# Altium schematic sheet Downstream_Port_1.SchDoc: = Title
size 431 x 279 mm; Revision: v1.0; SheetNumber: 5; SheetTotal: 7
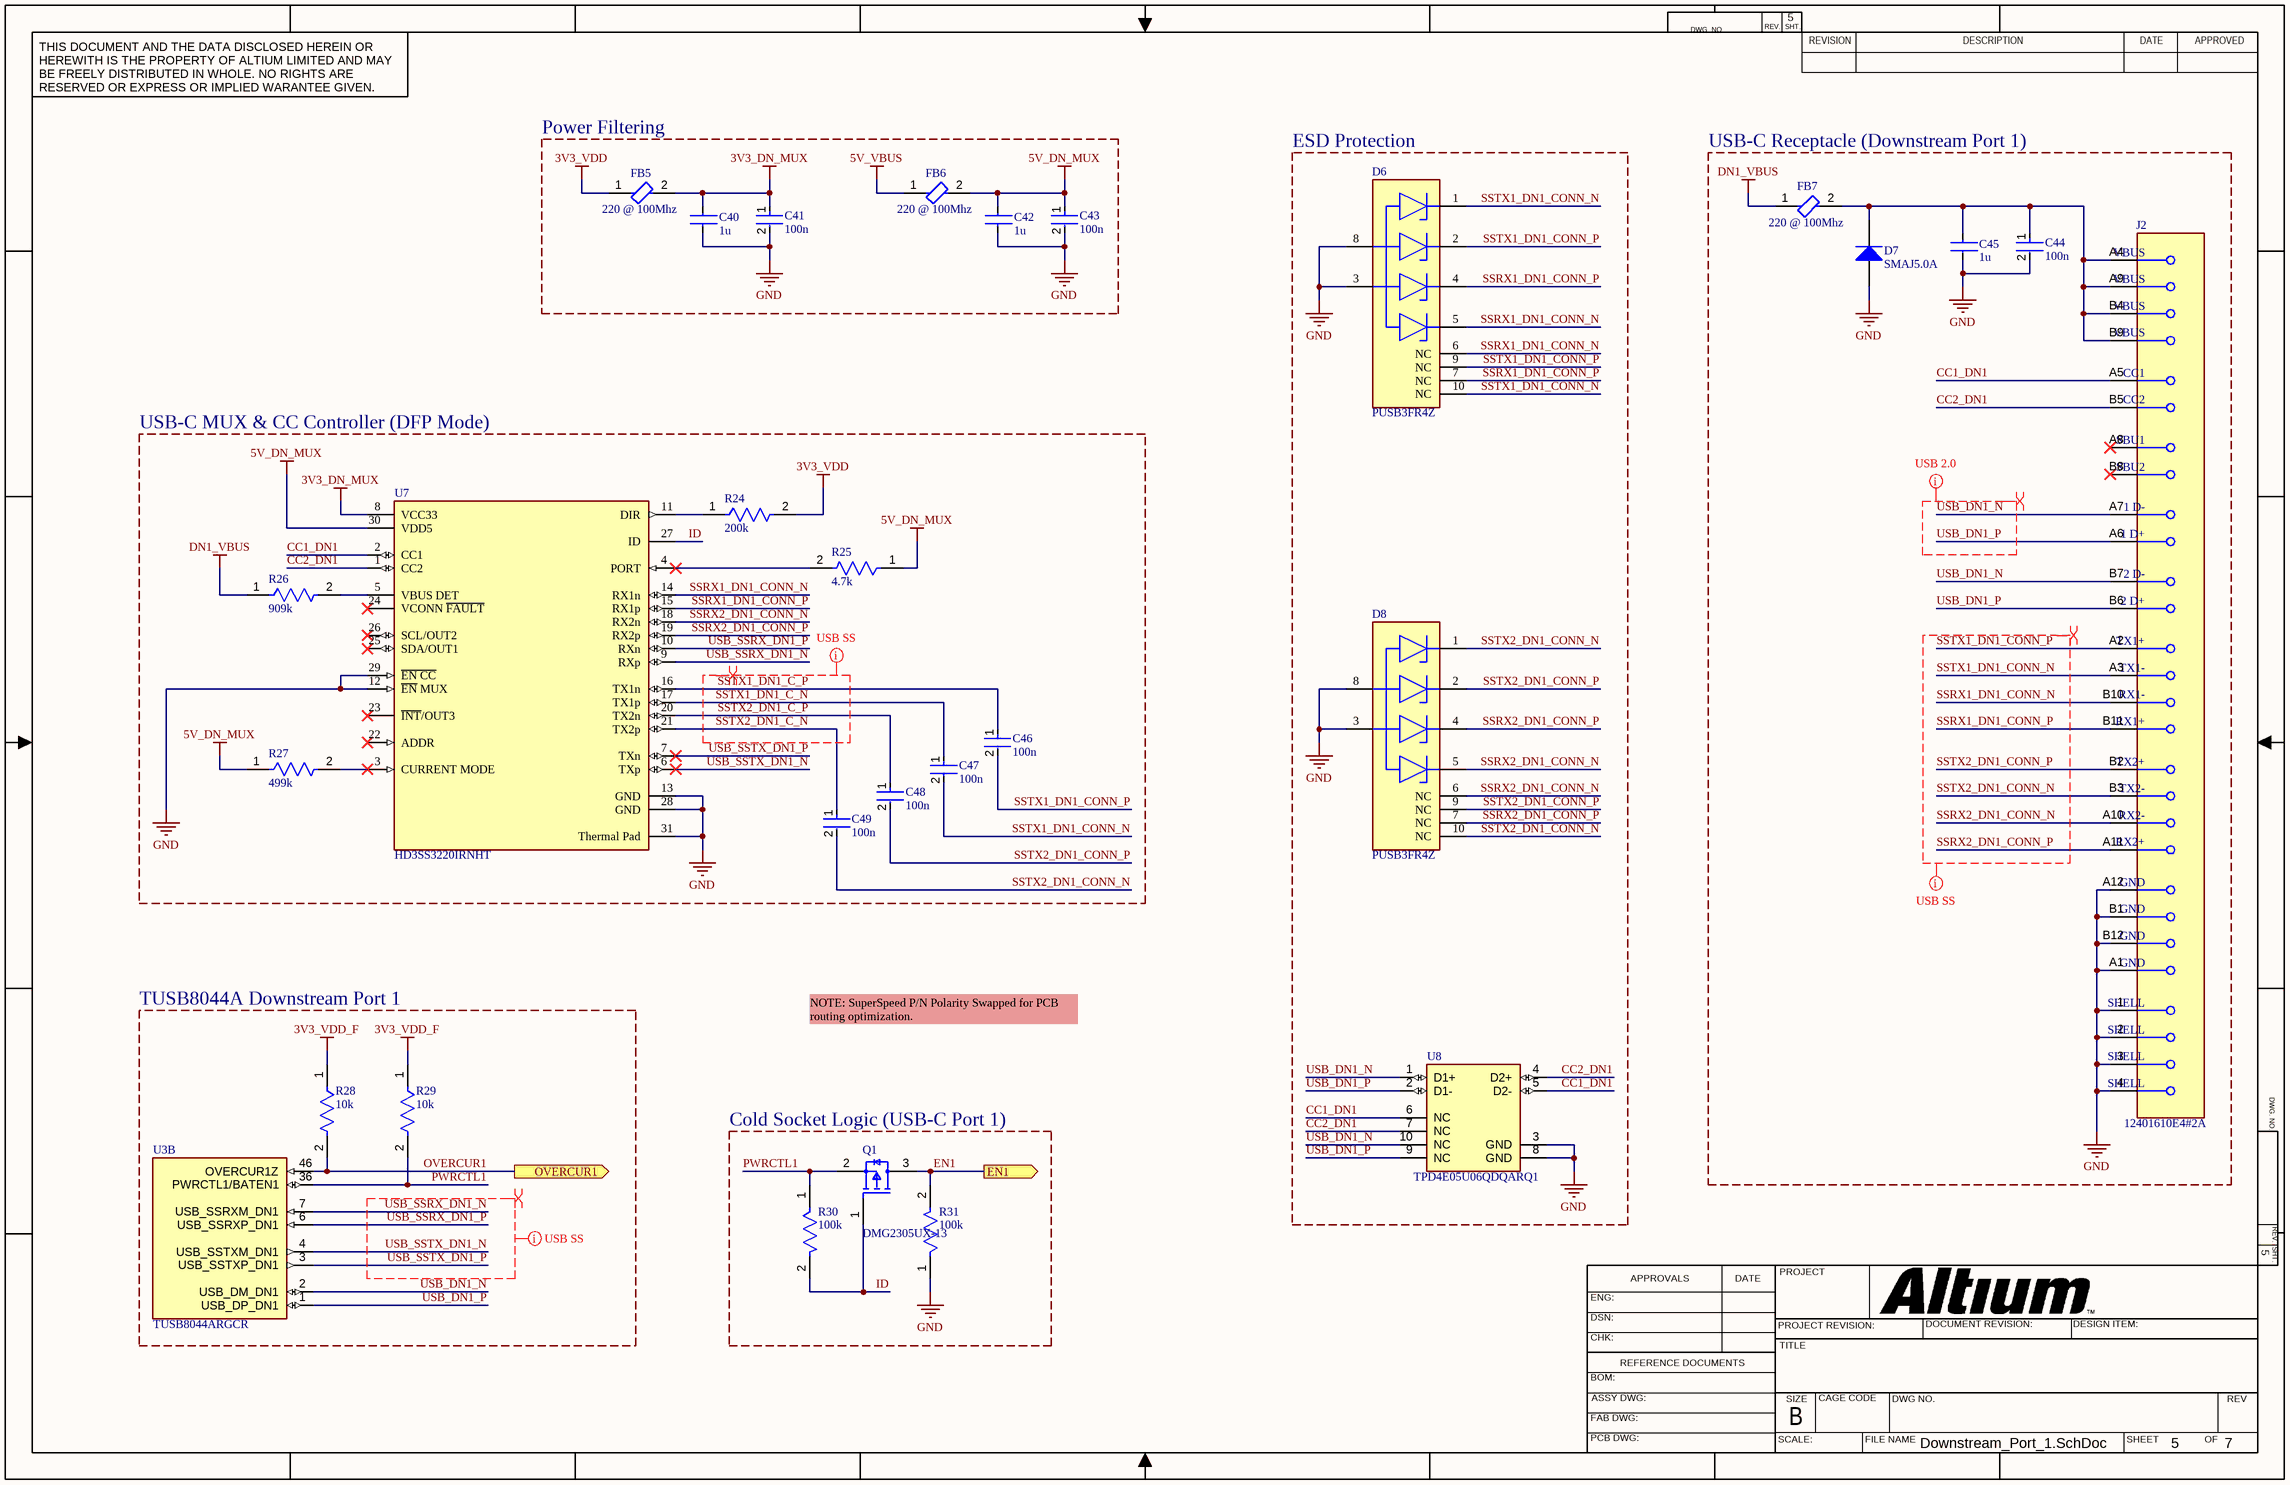
[diagram p0: Downstream_Port_1.SchDoc]

## Parts
C40  1u  [CAPC1608X90N]
C41  100n  [FP-GRT155-0_05-IPC_C]
C42  1u  [CAPC1608X90N]
C43  100n  [FP-GRT155-0_05-IPC_C]
C44  100n  [FP-GRT155-0_05-IPC_C]
C45  1u  [CAPC1608X90N]
C46  100n  [FP-GRT155-0_05-IPC_C]
C47  100n  [FP-GRT155-0_05-IPC_C]
C48  100n  [FP-GRT155-0_05-IPC_C]
C49  100n  [FP-GRT155-0_05-IPC_C]
D6  PUSB3FR4Z  [FP-SOT1176-1-MFG]
D7  SMAJ5.0A  [BOUR-SMA-2_V]
D8  PUSB3FR4Z  [FP-SOT1176-1-MFG]
FB5  220 @ 100Mhz  [FP-BLM21-0_2-t0_85-e0_5-IPC_B]
FB6  220 @ 100Mhz  [FP-BLM21-0_2-t0_85-e0_5-IPC_B]
FB7  220 @ 100Mhz  [FP-BLM21-0_2-t0_85-e0_5-IPC_B]
J2  12401610E4#2A  [FP-12401610E4#2A-MFG]
Q1  DMG2305UX-13  [FP-SOT23-MFG]
R24  200k  [FP-AC0402-MFG]
R25  4.7k  [FP-AC0402-MFG]
R26  909k  [FP-AC0402-IPC_A]
R27  499k  [FP-AC0402-IPC_C]
R28  10k  [FP-AC0402-MFG]
R29  10k  [FP-AC0402-MFG]
R30  100k  [FP-AC0402-MFG]
R31  100k  [FP-AC0402-MFG]
U3  TUSB8044ARGCR  [QFN50P900X900X100-65N-D]  (part B of 6)
U7  HD3SS3220IRNHT  [FP-RNH0030A-MFG]
U8  TPD4E05U06QDQARQ1  [FP-DQA0010A-MFG]

## Blocks framed on the sheet
Power Filtering: C40-C43 FB5 FB6
ESD Protection: D6 D8 U8
USB-C Receptacle (Downstream Port 1): C44 C45 D7 FB7 J2
USB-C MUX & CC Controller (DFP Mode): C46-C49 R24-R27 U7
TUSB8044A Downstream Port 1: R28 R29 U3
Cold Socket Logic (USB-C Port 1): Q1 R30 R31

## Ports
EN1 (out, see Top_Level[4D], Downstream_Port_2[6B]), OVERCUR1 (out, see Top_Level[3D], Downstream_Port_2[6B])

## Nets
3V3_DN_MUX: C40.2 C41.1 FB5.2 U7.8(VCC33)
3V3_VDD: FB5.1 R24.2
3V3_VDD_F: R28.1 R29.1
5V_DN_MUX: C42.2 C43.1 FB6.2 R25.1 R27.1 U7.30(VDD5)
5V_VBUS: FB6.1
DN1_VBUS: FB7.1 R26.1
GND: C40.1 C41.2 C42.1 C43.2 C44.2 C45.1 D6.3(GND) D6.8(GND) D7.1(A) D8.3(GND) D8.8(GND) J2.1(SHELL) J2.2(SHELL) J2.3(SHELL) J2.4(SHELL) J2.A1(GND) J2.A12(GND) J2.B1(GND) J2.B12(GND) R31.1 U7.12(~{EN}_MUX) U7.13(GND) U7.28(GND) U7.29(~{EN_CC}) U7.31(Thermal_Pad) U8.3(GND) U8.8(GND)
CC1_DN1: J2.A5(CC1) U7.2(CC1) U8.5(D2-) U8.6(NC)
CC2_DN1: J2.B5(CC2) U7.1(CC2) U8.4(D2+) U8.7(NC)
EN1: Q1.3(D) R31.2 ; port EN1
ID: Q1.1(G) R30.2 U7.27(ID)
OVERCUR1: R28.2 U3.46(OVERCUR1Z) ; port OVERCUR1
PWRCTL1: Q1.2(S) R29.2 R30.1 U3.36(PWRCTL1/BATEN1)
SSRX1_DN1_CONN_N: D6.5(CH4) D6.6(NC) J2.B10(RX1-) U7.14(RX1n)
SSRX1_DN1_CONN_P: D6.4(CH3) D6.7(NC) J2.B11(RX1+) U7.15(RX1p)
SSRX2_DN1_CONN_N: D8.5(CH4) D8.6(NC) J2.A10(RX2-) U7.18(RX2n)
SSRX2_DN1_CONN_P: D8.4(CH3) D8.7(NC) J2.A11(RX2+) U7.19(RX2p)
SSTX1_DN1_C_N: C47.1 U7.17(TX1p)
SSTX1_DN1_C_P: C46.1 U7.16(TX1n)
SSTX1_DN1_CONN_N: C47.2 D6.1(CH1) D6.10(NC) J2.A3(TX1-)
SSTX1_DN1_CONN_P: C46.2 D6.2(CH2) D6.9(NC) J2.A2(TX1+)
SSTX2_DN1_C_N: C49.1 U7.21(TX2p)
SSTX2_DN1_C_P: C48.1 U7.20(TX2n)
SSTX2_DN1_CONN_N: C49.2 D8.1(CH1) D8.10(NC) J2.B3(TX2-)
SSTX2_DN1_CONN_P: C48.2 D8.2(CH2) D8.9(NC) J2.B2(TX2+)
USB_DN1_N: J2.A7(1_D-) J2.B7(2_D-) U3.2(USB_DM_DN1) U8.1(D1+) U8.10(NC)
USB_DN1_P: J2.A6(1_D+) J2.B6(2_D+) U3.1(USB_DP_DN1) U8.2(D1-) U8.9(NC)
USB_SSRX_DN1_N: U3.7(USB_SSRXM_DN1) U7.9(RXp)
USB_SSRX_DN1_P: U3.6(USB_SSRXP_DN1) U7.10(RXn)
USB_SSTX_DN1_N: U3.4(USB_SSTXM_DN1) U7.6(TXp)
USB_SSTX_DN1_P: U3.3(USB_SSTXP_DN1) U7.7(TXn)
NetC44_1: C44.1 C45.2 D7.2(K) FB7.2 J2.A4(VBUS) J2.A9(VBUS) J2.B4(VBUS) J2.B9(VBUS)
NetR24_1: R24.1 U7.11(DIR)
NetR25_2: R25.2 U7.4(PORT)
NetR26_2: R26.2 U7.5(VBUS_DET)
NetR27_2: R27.2 U7.3(CURRENT_MODE)

Not connected (* = marked no-connect by the designer): J2 A8(SBU1)* B8(SBU2)*; U7 22(ADDR)* 23(~{INT}/OUT3)* 24(VCONN_~{FAULT})* 25(SDA/OUT1)* 26(SCL/OUT2)*

## Layout directives
differential pair: SSRX1_DN1_CONN_N, SSRX1_DN1_CONN_P, SSRX2_DN1_CONN_N, SSRX2_DN1_CONN_P, SSTX1_DN1_C_N, SSTX1_DN1_C_P, SSTX1_DN1_CONN_N, SSTX1_DN1_CONN_P, SSTX2_DN1_C_N, SSTX2_DN1_C_P, SSTX2_DN1_CONN_N, SSTX2_DN1_CONN_P, USB_DN1_N, USB_DN1_P, USB_SSRX_DN1_N, USB_SSRX_DN1_P, USB_SSTX_DN1_N, USB_SSTX_DN1_P
net class USB_HighSpeed: USB_DN1_N, USB_DN1_P
net class USB_SuperSpeed: SSRX1_DN1_CONN_N, SSRX1_DN1_CONN_P, SSRX2_DN1_CONN_N, SSRX2_DN1_CONN_P, SSTX1_DN1_C_N, SSTX1_DN1_C_P, SSTX1_DN1_CONN_N, SSTX1_DN1_CONN_P, SSTX2_DN1_C_N, SSTX2_DN1_C_P, SSTX2_DN1_CONN_N, SSTX2_DN1_CONN_P, USB_SSRX_DN1_N, USB_SSRX_DN1_P, USB_SSTX_DN1_N, USB_SSTX_DN1_P

## Notes on the sheet
- NOTE: SuperSpeed P/N Polarity Swapped for PCB routing optimization.
- DWG. NO.
- REV.
- SHT.
- THIS DOCUMENT AND THE DATA DISCLOSED HEREIN OR HEREWITH IS THE PROPERTY OF ALTIUM LIMITED AND MAY BE FREELY DISTRIBUTED IN WHOLE. NO RIGHTS ARE RESERVED OR EXPRESS OR IMPLIED WARANTEE GIVEN.
- REVISION
- DESCRIPTION
- DATE
- APPROVED
- ENG:
- APPROVALS
- PROJECT
- DSN:
- CHK:
- REFERENCE DOCUMENTS
- PROJECT REVISION:
- TITLE
- DOCUMENT REVISION:
- DESIGN ITEM:
- BOM:
- FAB DWG:
- PCB DWG:
- ASSY DWG:
- SCALE:
- SIZE
- B
- CAGE CODE
- FILE NAME
- DWG NO.
- SHEET
- OF
- REV

## Library data of the parts
C40 C42 C45 = C1608X7R1H105K080AB: The superior mechanical strength and reliability due to the monolithic structure.  Low ESR, ESL and excellent frequency characteristics allow for a circuit design that closely conforms to theoretical values.  Low self-heating and high ripple resistance due to low ESR.  No polarity; Manufacturer_Name: TDK; Geometry.Height: 0.9mm; Mouser Part Number: 810-C1608X7R1H105K08; Mouser Price/Stock: https://www.mouser.co.uk/ProductDetail/TDK/C1608X7R1H105K080AB?qs=efUn273yAhdzCWVW9RXgig%3D%3D; Manufacturer_Part_Number: C1608X7R1H105K080AB; Datasheet Link: https://media.digikey.com/pdf/Data%20Sheets/TDK%20PDFs/mlcc_commercial_general_Rev2018.pdf
C41 C43 C44 C46-C49 = CMP-06035-030480-1: Multi-Layer Ceramic Capacitor 100nF 50V X7R ±10% 0402 Paper T/R
D6 D8 = CMP-14432-000005-1: TVS DIODE 3.3VWM 3VC DFN2510A-10; RoHS Compliant: Yes
D7 = CMP-2000-07090-1: SMAJ Transient Voltage Suppressor Diode Series, 3.5 V, -55 to 150 degC, 2-Pin SMA, RoHS, Tape and Reel; Manufacturer: Bourns; EDA / CAD Models: DownloadfromAcceleratedDesigns; Unidirectional Channels: 1; Voltage - Breakdown (Min): 6.4V; Voltage - Reverse Standoff (Typ): 5V; Voltage - Clamping (Max) @ Ipp: 9.2V; Other Names: SMAJ5.0ABDKR; Type: Zener; Catalog Drawings: SMAJSeriesFootprintSMAJ,SMBJSeries; Featured Product: SMAJ/SMBJ/SMCJ/SMLJDiscreteTVSDiodes; Power - Peak Pulse: 400W; Current - Peak Pulse (10/1000µs): 43.5A; Power Line Protection: No; Online Catalog: SMAJSeries; Supplier Device Package: SMA(DO-214AC); Operating Temperature: -55°C~150°C(TJ); Package Description: 2-Pin Surface Mount Device, Body 4.315 x 2.605 mm; Datasheet URL: https://datasheet.ciiva.com/25624/0900766b8112213b-25624680.pdf; Manufacturer URL: http://www.bourns.com/; Datasheet Version: 08/2012; Series: SMAJ; Family: TVS-Diodes; Bidirectional Channels: -; Applications: GeneralPurpose; Package Reference: SMA-2; Standard Package: 1; Package / Case: DO-214AC,SMA; Category: CircuitProtection; RoHS Information: SMAJSeriesMaterialDeclaration; Mounting Technology: SurfaceMount; Capacitance @ Frequency: -; Packaging: Digi-Reel®; Mounting Type: SurfaceMount
FB5-FB7 = CMP-0686-00610-3: Chip Ferrite Bead, 0805, 220Ω @ 100MHz, 0.045Ω, 25%, 2A; Number of Circuits: 1; Shielding: Unshielded; DC Resistance (DCR): 45mR; Impedance: 220R; Radiation Hardening: No; Material: Ferrite; Frequency: 100MHz; Width: 1.25mm; DC Current: 2A; Max DC Current: 2A; Number of Lines: 1; Package Quantity: 1; Case Code (Metric): 2012; Current Rating: 2A; Case/Package: 0805; Current: 2A; Military Standard: Not; Core Material: Ferrite; Depth: 1.25mm; Contact Plating: Tin; DC Resistance-Max: 45mR; Max Operating Temperature: 125°C; Length: 2mm; Max Current Rating: 2A; REACH SVHC: No SVHC; Termination: SMD/SMT; Min Operating Temperature: -55°C; Series: BLM21P; Test Frequency: 100MHz; Tolerance: 25%; Number of Pins: 2; RoHS Compliant: Yes; Height: 0.85mm; Packaging: Tape and Reel; Lead Free: Lead Free; Case Code (Imperial): 0805
J2 = CMP-02355-000003-1: CONN RCP USB3.1 TYPEC 24P SMD RA; Connector Type: USB; Number of Contacts: 24; Gender: Receptacle; Packaging: Cut Tape; Mount: Surface Mount; Number of Pins: 24
Q1 = CMP-12801-000021-1: MOSFET P-CH 20V 4.2A SOT23; Manufacturer: Diodes Inc.; Input Capacitace At Vds: 808pF @ -15V; Rthja Max: 90°C/W; Drain To Source Voltage: -20V; Standoff Height: 0.013mm; Number Of P Channels: 1; Gate To Source Voltage: 8V; Turn On Delay Time: 10.8ns; Pulse Drain Current: -15A; Threshold Vgs Max: -0.9V; Max Junction Temp: +150°C; Depletion Mode: False; Drain To Source Resistance: 40mΩ; Threshold Vgs Min: -0.5V; Continuous Drain Current: -4.2A; Turn Off Delay Time: 79.3ns; Gate Charge At Vgs: 10.2nC @ -4.5V; Power Dissipation: 1.4W; Digikey Description: MOSFET P-CH 20V 4.2A SOT23; Temperature Range High: +150°C; Height: 1.1mm; Package: SOT23; Footprint Url: https://www.diodes.com/assets/Package-Files/SOT23.pdf; Device Class L3: MOSFETs; RoHS: TRUE; Temperature: -55°C to +150°C; Mouser Description: MOSFET P-Ch ENH FET -20V 52mOhm -5.0V; Temperature Range Low: -55°C; ComponentLink2Description: Datasheet; Manufacturer Part Number: DMG2305UX-13; Octopart: https://octopart.com/dmg2305ux-13-diodes+inc.-29925594; Ipc Land Pattern Name: SOT92P240X102-3; Device Class L2: Transistors; Automotive: No; Number Of Channels: 1; Drain To Source Breakdown Voltage: -20V; Lead Free: Yes; Device Class L1: Discrete Semiconductors; Category: Trans; ComponentLink2URL: https://www.diodes.com/assets/Datasheets/DMG2305UX.pdf
R24 = CMP-03412-002362-2: RES 200kΩ ±1% 0.063W 0402; Temperature Coefficient: 100ppm/°C; Voltage Rating: 50V; Max Power Dissipation: 63mW; Power Rating: 62.5mW; Resistance: 200kR; RoHS Compliant: Yes; Series: AC; Height: 0.015inch; Termination: SMD/SMT; Case Code (Imperial): 0402; Min Operating Temperature: -55°C; Weight: 2.3E-05oz; Case Code (Metric): 1005; Case/Package: 0402; Max Operating Temperature: 155°C; Width: 0.5mm; Size Code: 0402; Features: Moisture Resistant; Number of Terminations: 2; Tolerance: 1%; Packaging: Tape and Reel; Lead Free: Lead Free; Resistor Type: Thick Film; Length: 0.039inch
R25 = CMP-03412-009386-2: RES 4.7kΩ ±1% 0.063W 0402
R26 = CMP-03412-019105-2: RES 909kΩ ±1% 0.063W 0402; Power Rating: 62.5mW; Voltage Rating: 50V; Resistance: 909kR; Temperature Coefficient: 100ppm/°C; Max Power Dissipation: 63mW; Number of Terminations: 2; Packaging: Tape and Reel; Height: 0.015inch; Max Operating Temperature: 155°C; Series: AC; Resistor Type: Thick Film; Features: Moisture Resistant; Width: 0.5mm; RoHS Compliant: Yes; Length: 0.039inch; Case/Package: 0402; Min Operating Temperature: -55°C; Tolerance: 1%; Termination: SMD/SMT; Case Code (Imperial): 0402; Case Code (Metric): 1005
R27 = CMP-03412-006289-2: RES 499kΩ ±1% 0.063W 0402; Resistance: 499kR; Max Power Dissipation: 63mW; Temperature Coefficient: 100ppm/°C; Case/Package: 0402; Tolerance: 1%; Series: AC; Number of Terminations: 2; Features: Moisture Resistant; Case Code (Imperial): 0402; Packaging: Tape and Reel; Resistor Type: Thick Film; Min Operating Temperature: -55°C; RoHS Compliant: Yes; Ratings: AEC-Q200; Width: 0.02inch; Length: 0.039inch; Height: 0.015inch; Max Operating Temperature: 155°C; Case Code (Metric): 1005
R28 R29 = CMP-2002-01790-3: RES 10kΩ ±1% 0.063W 0402; Power Rating: 62.5mW; Voltage Rating: 50V; Temperature Coefficient: 100ppm/°C; Resistance: 10kR; Max Power Dissipation: 63mW; Tolerance: 1%; Military Standard: Not; Construction: Rectangular; Termination: SMD/SMT; Max Operating Temperature: 155°C; Min Operating Temperature: -55°C; Height: 0.015inch; Lead Free: Lead Free; Width: 0.02inch; Case/Package: 0402; Resistor Type: Thick Film; Series: AC; Features: Moisture Resistant; RoHS Compliant: Yes; Number of Terminations: 2; Case Code (Metric): 1005; Length: 0.039inch; Depth: 0.5mm; Size Code: 0402; Packaging: Tape and Reel; Case Code (Imperial): 0402
R30 R31 = CMP-03412-039042-1: RES 100kΩ ±1% 0.125W 0402
U3 = TUSB8044ARGCR: Four-port USB 3.2 x1 Gen1 hub with USB billboard; Manufacturer_Name: Texas Instruments; Geometry.Height: 1mm; Mouser Part Number: 595-TUSB8044ARGCR; Mouser Price/Stock: https://www.mouser.co.uk/ProductDetail/Texas-Instruments/TUSB8044ARGCR?qs=9r4v7xj2LnlTBCFutY1Bfg%3D%3D; Manufacturer_Part_Number: TUSB8044ARGCR; Datasheet Link: http://www.ti.com/lit/gpn/TUSB8044A
U7 = CMP-04877-000019-1: USB TYPE-C DRP PORT CONTROLLER W; Max Supply Voltage: 5.5V; Min Supply Voltage: 3V; Number of Ports: 1; Data Rate: 10Gbps; USB Standard: USB 3.1; Mount: Surface Mount; Max Operating Temperature: 70°C; Lead Free: Lead Free; RoHS Compliant: Yes; Packaging: Tape and Reel; Number of Pins: 30; Min Operating Temperature: 0°C; REACH SVHC: No SVHC
U8 = CMP-04985-000004-1: TVS DIODE 5.5V 14V 10USON; Manufacturer: Texas Instruments; Direction: Unidirectional; Standoff Height: 0mm; Capacitance: 0.5pF; Number Of Channels: 4; Breakdown Voltage: 6.4V; Peak Pulse Power: 2.5W; Automotive Grade: Grade 1; Value: 0.5pF; Interface: USB,Ethernet,LVDS,Other; Peak Pulse Current: 2.5A; Operating Supply Voltage: 5.5V; Reverse Standoff Voltage: 5.5V; Package: DQA0010A; Temperature Range Low: -40°C; Temperature Range High: +125°C; Ambient Temperature Range Low: -40°C; Device Class L1: Circuit Protection; Clamping Voltage: 14V; Manufacturer Part Number: TPD4E05U06QDQARQ1; Device Class L2: ESD and Circuit Protection ICs; Octopart: https://octopart.com/tpd4e05u06qdqarq1-texas+instruments-48523459; Device Class L3: unset; Height: 0.55mm; Automotive: Yes; ComponentLink2Description: Datasheet; RoHS: TRUE; Ambient Temperature Range High: +125°C; Category: IC; Mouser Description: Automotive 4-Channel ESD Protection Solution for SuperSpeed (up to 5 Gbps) Interface 10-USON -40 to 125; Temperature: -40°C to +125°C; ComponentLink2URL: http://www.ti.com/lit/ds/symlink/tpd4e05u06-q1.pdf; Digikey Description: TVS DIODE 5.5V 14V 10USON; Lead Free: Yes